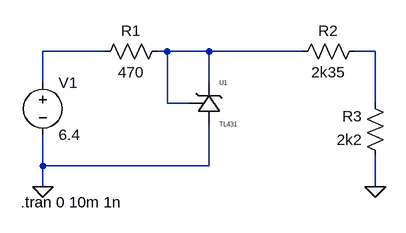
[diagram p0: schematic Vref_v1.asc]
Vref_v1.asc, the LTspice schematic file:
Version 4
SHEET 1 880 680
WIRE 32 80 -64 80
WIRE 128 80 112 80
WIRE 192 80 128 80
WIRE 336 80 192 80
WIRE 448 80 416 80
WIRE -64 128 -64 80
WIRE 192 128 192 80
WIRE 128 160 128 80
WIRE 160 160 128 160
WIRE 448 160 448 80
WIRE -64 256 -64 208
WIRE 192 256 192 192
WIRE 192 256 -64 256
WIRE -64 288 -64 256
WIRE 448 288 448 240
FLAG -64 288 0
FLAG 448 288 0
SYMBOL ZZZ\\REF\\TL431 176 128 R0
SYMATTR InstName U1
SYMBOL voltage -64 112 R0
WINDOW 123 0 0 Left 0
WINDOW 39 0 0 Left 0
SYMATTR InstName V1
SYMATTR Value 6.4
SYMBOL res 128 64 R90
WINDOW 0 0 56 VBottom 2
WINDOW 3 32 56 VTop 2
SYMATTR InstName R1
SYMATTR Value 470
SYMBOL res 432 64 R90
WINDOW 0 0 56 VBottom 2
WINDOW 3 32 56 VTop 2
SYMATTR InstName R2
SYMATTR Value 2k35
SYMBOL res 464 256 R180
WINDOW 0 36 76 Left 2
WINDOW 3 36 40 Left 2
SYMATTR InstName R3
SYMATTR Value 2k2
TEXT -98 312 Left 2 !.tran 0 10m 1n

The netlist it stands for:
* Vref_v1.asc
XU1 0 N002 N002 TL431  ; pins A K R
V1 N001 0 6.4
R1 N002 N001 470
R2 N003 N002 2k35
R3 0 N003 2k2
.tran 0 10m 1n
.backanno
.end